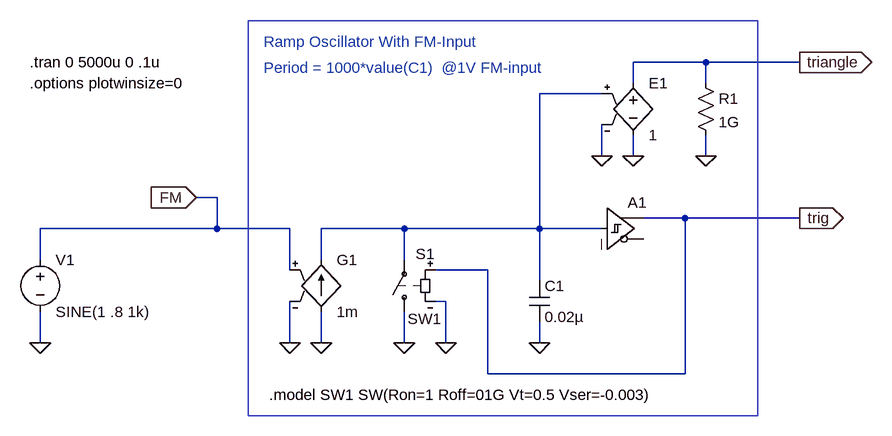
[diagram p0: schematic modulated_sawtooth2.asc]
modulated_sawtooth2.asc, the LTspice schematic file:
Version 4
SHEET 1 880 680
WIRE -880 192 -880 144
WIRE -880 320 -880 272
WIRE -608 96 -640 96
WIRE -608 144 -880 144
WIRE -608 144 -608 96
WIRE -496 144 -608 144
WIRE -496 208 -496 144
WIRE -496 320 -496 256
WIRE -448 192 -448 144
WIRE -448 320 -448 272
WIRE -320 144 -448 144
WIRE -320 192 -320 144
WIRE -320 320 -320 272
WIRE -256 256 -272 256
WIRE -256 320 -256 256
WIRE -192 208 -272 208
WIRE -192 368 -192 208
WIRE -112 144 -320 144
WIRE -112 144 -112 -64
WIRE -112 224 -112 144
WIRE -112 320 -112 288
WIRE -16 -64 -112 -64
WIRE -16 32 -16 -16
WIRE -16 144 -112 144
WIRE 32 -80 32 -112
WIRE 32 32 32 0
WIRE 112 128 48 128
WIRE 112 368 -192 368
WIRE 112 368 112 128
WIRE 144 -112 32 -112
WIRE 144 -80 144 -112
WIRE 144 32 144 0
WIRE 288 -112 144 -112
WIRE 288 128 112 128
FLAG -112 320 0
FLAG -448 320 0
FLAG -496 320 0
FLAG -880 320 0
FLAG -256 320 0
FLAG -320 320 0
FLAG 288 128 trig
IOPIN 288 128 Out
FLAG -16 32 0
FLAG 32 32 0
FLAG 288 -112 triangle
IOPIN 288 -112 Out
FLAG -640 96 FM
IOPIN -640 96 In
FLAG 144 32 0
SYMBOL Digital\\schmitt -16 80 R0
SYMATTR InstName A1
SYMATTR Value2 vt=0.5 vh=0.5
SYMATTR SpiceLine td=5n
SYMBOL cap -128 224 R0
SYMATTR InstName C1
SYMATTR Value 0.02µ
SYMBOL g -448 176 R0
SYMATTR InstName G1
SYMATTR Value 1m
SYMBOL voltage -880 176 R0
WINDOW 123 0 0 Left 0
WINDOW 39 0 0 Left 0
SYMATTR InstName V1
SYMATTR Value SINE(1 .8 1k)
SYMBOL sw -320 288 R180
WINDOW 0 -47 105 Left 0
WINDOW 3 -57 5 Left 0
SYMATTR InstName S1
SYMATTR Value SW1
SYMBOL e 32 -96 R0
SYMATTR InstName E1
SYMATTR Value 1
SYMBOL res 128 -96 R0
SYMATTR InstName R1
SYMATTR Value 1G
TEXT -896 -112 Left 0 !.tran 0 5000u 0 .1u
TEXT -896 -80 Left 0 !.options plotwinsize=0
TEXT -528 400 Left 0 !.model SW1 SW(Ron=1 Roff=01G Vt=0.5 Vser=-0.003)
TEXT -536 -144 Left 0 ;Ramp Oscillator With FM-Input
TEXT -536 -104 Left 0 ;Period = 1000*value(C1)  @1V FM-input
RECTANGLE Normal 224 432 -560 -176

The netlist it stands for:
* modulated_sawtooth2.asc
A1 N001 0 0 0 0 0 trig 0 SCHMITT vt=0.5 vh=0.5 td=5n
C1 N001 0 0.02µ
G1 0 N001 FM 0 1m
V1 FM 0 SINE(1 .8 1k)
S1 0 N001 trig 0 SW1
E1 triangle 0 N001 0 1
R1 triangle 0 1G
.tran 0 5000u 0 .1u
.options plotwinsize=0
.model SW1 SW(Ron=1 Roff=01G Vt=0.5 Vser=-0.003)
* Ramp Oscillator With FM-Input
* Period = 1000*value(C1)  @1V FM-input
.backanno
.end